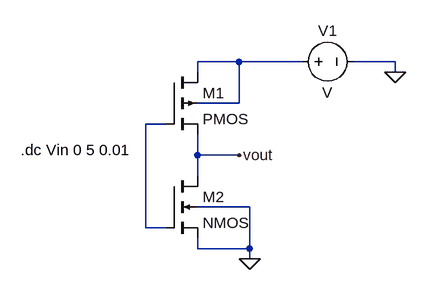
[diagram p0: schematic cmosinv.asc]
cmosinv.asc, the LTspice schematic file:
Version 4.1
SHEET 1 880 680
WIRE 320 32 256 32
WIRE 416 32 320 32
WIRE 560 32 496 32
WIRE 256 48 256 32
WIRE 560 48 560 32
WIRE 320 96 320 32
WIRE 320 96 256 96
WIRE 208 128 176 128
WIRE 256 176 256 144
WIRE 320 176 256 176
WIRE 256 208 256 176
WIRE 336 256 256 256
WIRE 176 288 176 128
WIRE 208 288 176 288
WIRE 256 320 256 304
WIRE 336 320 336 256
WIRE 336 320 256 320
WIRE 336 336 336 320
FLAG 560 48 0
FLAG 336 336 0
FLAG 320 176 vout
SYMBOL pmos4 208 48 R0
SYMATTR InstName M1
SYMBOL nmos4 208 208 R0
SYMATTR InstName M2
SYMBOL voltage 400 32 R270
WINDOW 0 32 56 VTop 2
WINDOW 3 -32 56 VBottom 2
SYMATTR InstName V1
TEXT -16 168 Left 2 !.dc Vin 0 5 0.01

The netlist it stands for:
* cmosinv.asc
M1 N001 N002 vout N001 PMOS
M2 vout N002 0 0 NMOS
V1 N001 0 V
.model NMOS NMOS
.model PMOS PMOS
.lib standard.mos
.dc Vin 0 5 0.01
.backanno
.end